# Altium project Kasil_DIOT_x86_board.PrjPcb (part 4 of 4)

## Sheet PCIe_MUX_CLK.SchDoc
size 420 x 297 mm; SheetNumber: 10; SheetTotal: 11; ModifiedBy: -; CheckedDate: -; Title2: Title 2; DivGrp: WUT ISE; Designer: G.Kasprowicz
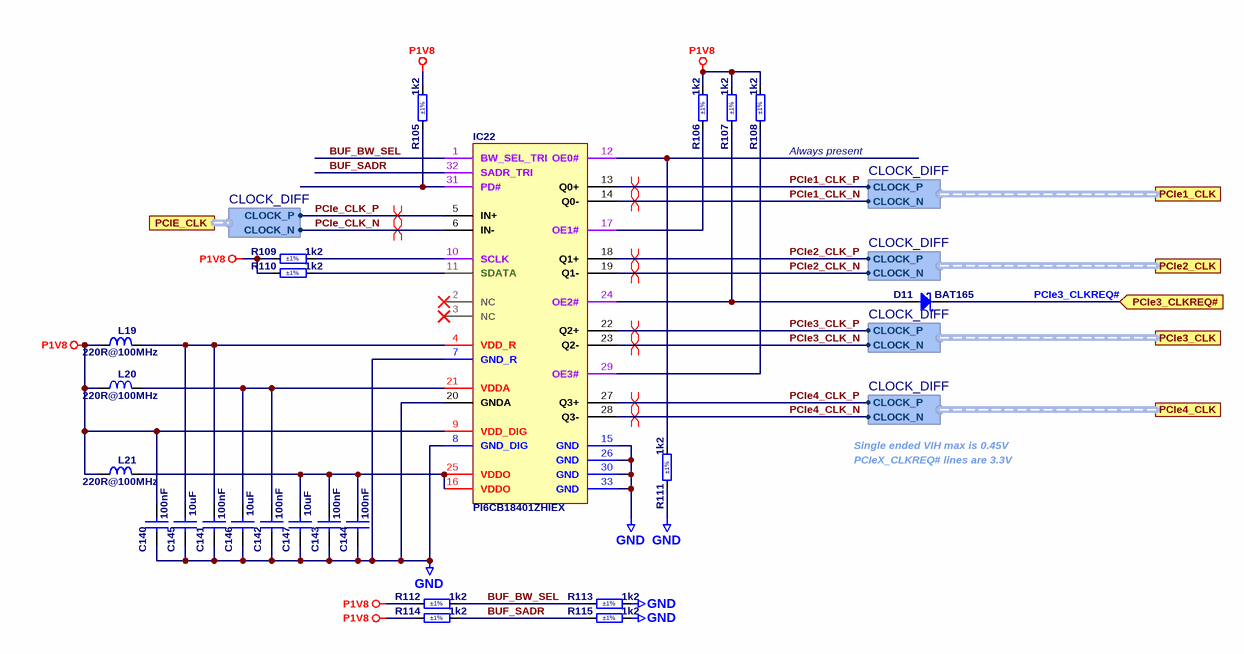
[diagram p9: PCIe_MUX_CLK.SchDoc]

### Parts
C140  100nF  [CAPC1005X55N]
C141  100nF  [CAPC1005X55N]
C142  100nF  [CAPC1005X55N]
C143  100nF  [CAPC1005X55N]
C144  100nF  [CAPC1005X55N]
C145  10uF  [CAPC1608X80N]
C146  10uF  [CAPC1608X80N]
C147  10uF  [CAPC1608X80N]
D11  BAT165  [SOD2512X110N]
IC22  PI6CB18401ZHIEX  [PERICOM_32-TQFN(ZH)]
L19  220R@100MHz  [INDC2012X105N]
L20  220R@100MHz  [INDC2012X105N]
L21  220R@100MHz  [INDC2012X105N]
R105  1k2  Tolerance: ±1%  [RESC1005X40N]
R106  1k2  Tolerance: ±1%  [RESC1005X40N]
R107  1k2  Tolerance: ±1%  [RESC1005X40N]
R108  1k2  Tolerance: ±1%  [RESC1005X40N]
R109  1k2  Tolerance: ±1%  [RESC1005X40N]
R110  1k2  Tolerance: ±1%  [RESC1005X40N]
R111  1k2  Tolerance: ±1%  [RESC1005X40N]
R112  1k2  Tolerance: ±1%  [RESC1005X40N]
R113  1k2  Tolerance: ±1%  [RESC1005X40N]
R114  1k2  Tolerance: ±1%  [RESC1005X40N]
R115  1k2  Tolerance: ±1%  [RESC1005X40N]

### Ports
PCIe1_CLK (harness CLOCK_DIFF), PCIe2_CLK (harness CLOCK_DIFF), PCIe3_CLK (harness CLOCK_DIFF), PCIe3_CLKREQ# (in), PCIe4_CLK (harness CLOCK_DIFF), PCIE_CLK (harness CLOCK_DIFF)

### Harnesses
CLOCK_DIFF: CLOCK_P, CLOCK_N

### Nets
GND: C140.1 C141.1 C142.1 C143.1 C144.1 C145.1 C146.1 C147.1 IC22.7(GND_R) IC22.8(GND_DIG) IC22.15(GND) IC22.20(GNDA) IC22.26(GND) IC22.30(GND) IC22.33(GND) R111.1 R113.2 R115.2
P1V8: C140.2 IC22.9(VDD_DIG) L19.1 L20.1 L21.1 R105.2 R106.2 R107.2 R108.2 R109.1 R110.1 R112.1 R114.1
BUF_BW_SEL: IC22.1(BW_SEL_TRI) R112.2 R113.1
BUF_SADR: IC22.32(SADR_TRI) R114.2 R115.1
PCIe1_CLK_N: IC22.14(Q0-) ; port PCIe1_CLK.CLOCK_N
PCIe1_CLK_P: IC22.13(Q0+) ; port PCIe1_CLK.CLOCK_P
PCIe2_CLK_N: IC22.19(Q1-) ; port PCIe2_CLK.CLOCK_N
PCIe2_CLK_P: IC22.18(Q1+) ; port PCIe2_CLK.CLOCK_P
PCIe3_CLK_N: IC22.23(Q2-) ; port PCIe3_CLK.CLOCK_N
PCIe3_CLK_P: IC22.22(Q2+) ; port PCIe3_CLK.CLOCK_P
PCIe3_CLKREQ#: D11.1(C) ; port PCIe3_CLKREQ#
PCIe4_CLK_N: IC22.28(Q3-) ; port PCIe4_CLK.CLOCK_N
PCIe4_CLK_P: IC22.27(Q3+) ; port PCIe4_CLK.CLOCK_P
PCIe_CLK_N: IC22.6(IN-) ; port PCIE_CLK.CLOCK_N
PCIe_CLK_P: IC22.5(IN+) ; port PCIE_CLK.CLOCK_P
NetC141_2: C141.2 C145.2 IC22.4(VDD_R) L19.2
NetC142_2: C142.2 C146.2 IC22.21(VDDA) L20.2
NetC143_2: C143.2 C144.2 C147.2 IC22.16(VDDO) IC22.25(VDDO) L21.2
NetD11_2: D11.2(A) IC22.24(OE2#) R107.1
NetIC22_10: IC22.10(SCLK) R109.2
NetIC22_11: IC22.11(SDATA) R110.2
NetIC22_12: IC22.12(OE0#) R111.2
NetIC22_17: IC22.17(OE1#) R106.1
NetIC22_29: IC22.29(OE3#) R108.1
NetIC22_31: IC22.31(PD#) R105.1

Not connected (* = marked no-connect by the designer): IC22 2(NC)* 3(NC)*

### Layout directives
differential pair: PCIe1_CLK_N, PCIe1_CLK_P, PCIe2_CLK_N, PCIe2_CLK_P, PCIe3_CLK_N, PCIe3_CLK_P, PCIe4_CLK_N, PCIe4_CLK_P, PCIe_CLK_N, PCIe_CLK_P

### Notes on the sheet
- (near R108) Always present
- Single ended VIH max is 0.45V
- PCIeX_CLKREQ# lines are 3.3V
- Project/Equipment
- Document
- Designer
- Drawn by
- Check.by
- Copyright WUT ISE 2024.
  This documentation describes Open Hardware and is licensed under the CERN OHL v.2. You may redistribute and modify this documentation under the terms of the CERN OHL v.2. (http://ohwr.org/CERNOHL). This documentation is distributed WITHOUT ANY EXPRESS OR IMPLIED WARRANTY, INCLUDING OF MERCHANTABILITY, SATISFACTORY QUALITY AND FITNESS FOR A PARTICULAR PURPOSE. Please see the CERN OHL v.2 for applicable conditions.
- Contact
- File
- Last Mod.
- Print Date
- Sheet
- Size
- A3
- of
- Rev

### Library data of the parts
C140-C144 = CC0402_100NF_16V_10%_X7R: Non-polarised capacitor; Part Description: SMD Multilayer Chip Ceramic Capacitor; Manufacturer: GENERIC; Manufacturer1 Part Number: GRM155R71C104KA88D; Voltage: 16V; TC: X7R; Tolerance: ±10%; Part Number: CC0402_100NF_16V_10%_X7R; Component Kind: Standard; Component Type: Standard; Pin Count: 2; Value: 100nF; Status: Not Recommended; Manufacturer Part Number: CC0402_100NF_16V_10%_X7R; Case: 0402; Mounted: Yes; Socket: No; SMD: Yes; Sense: No; Manufacturer1 Example: MURATA; Manufacturer1 ComponentHeight: 0.55mm; HelpURL: \\cern.ch\dfs\Applications\Altium\Datasheets\CC0402_X7R_MURATA_GRM.pdf; Author: CERN DEM JLC; CreateDate: 05/12/2013; LatestRevisionDate: 03/12/2007
C145-C147 = CC0603_10UF_16V_20%_X5R: Non-polarised capacitor; Part Description: SMD Multilayer Chip Ceramic Capacitor; Manufacturer: GENERIC; Manufacturer1 Part Number: GRM188R61C106MA73D; Voltage: 16V; TC: X5R; Tolerance: ±20%; Part Number: CC0603_10UF_16V_20%_X5R; Component Kind: Standard; Component Type: Standard; Pin Count: 2; Value: 10uF; Status: None; Manufacturer Part Number: CC0603_10UF_16V_20%_X5R; Case: 0603; Mounted: Yes; Socket: No; SMD: Yes; Sense: No; Manufacturer1 Example: MURATA; Manufacturer1 ComponentHeight: 0.8mm; HelpURL: \\cern.ch\dfs\Applications\Altium\Datasheets\CC0603_X5R_MURATA_GRM.pdf; Author: CERN DEM MR; CreateDate: 02.03.2016; LatestRevisionDate: 02.03.2016
D11 = BAT165: Schottky Diode; Part Description: Medium Power AF Schottky Diode; Manufacturer: INFINEON; Voltage: 40V; Power: 750mA; PressFit: No; Bonding: No; Part Number: BAT165; Component Kind: Standard; Component Type: Standard; Device: BAT165; PackageDescription: Small Outline Diode (SOD-323), 1.70mm W X 1.25mm L X 1.10mm H body,  IPC Medium Density; Manufacturer Part Number: BAT165; Pin Count: 2; Case: SOD-323; Mounted: Yes; Socket: No; SMD: Yes; Sense: No; ComponentHeight: 1.1mm; HelpURL: \\cern.ch\dfs\Applications\Altium\Datasheets\BAT165.pdf; Author: CERN DEM JLC; CreateDate: 12.11.2014; LatestRevisionDate: 12.11.2014
IC22 = PI6CB18401: Very Low Power 4-Output PCIe Clock Buffer With On-chip Termination
L19-L21 = IND0805_MURATA_BLM21PG221SN1D: Inductor; Part Description: SMD EMIFIL Suppression Chip Bead Ferrite; Manufacturer: MURATA; Power: 2A; Resistance: 0.05R; Tolerance: ±25%; Table: Inductors SMD; Part Number: IND0805_MURATA_BLM21PG221SN1D; Component Kind: Standard; Component Type: Standard; Pin Count: 2; Value: 220R@100MHz; Status: None; Manufacturer Part Number: BLM21PG221SN1D; Case: 0805; Mounted: Yes; Socket: No; SMD: Yes; ComponentHeight: 1.05mm; HelpURL: \\cern.ch\dfs\Applications\Altium\Datasheets\IND0402_MURATA_BLM21P.pdf; Author: CERN DEM JLC; CreateDate: 25/01/2010; LatestRevisionDate: 25/01/2010
R105-R115 = R0402_1K2_1%_0.0625W_100PPM: Resistor - 1%; Part Description: General Purpose Thick Film Chip Resistor; Manufacturer: GENERIC; Manufacturer 1: YAGEO PHYCOMP; Manufacturer 1 Part Number: 232270671202L; TC: ±100ppm/°C; PressFit: No; Part Number: R0402_1K2_1%_0.0625W_100PPM; Component Kind: Standard; Component Type: Standard; Pin Count: 2; Value: 1k2; Status: Not Recommended; Power: 0.0625W; Manufacturer Part Number: R0402_1K2_1%_0.0625W_100PPM; Case: 0402; Mounted: Yes; Sense: No; Socket: No; SMD: Yes; Manufacturer1 ComponentHeight: 0.4mm; HelpURL: \\cern.ch\dfs\Applications\Altium\Datasheets\R0402_Phycomp_RC0402.pdf; Author: CERN DEM JLC; CreateDate: 03.12.2007; LatestRevisionDate: 17.10.2012

## Sheet DualUSB2.0_HDR.SchDoc
size 420 x 297 mm; SheetNumber: 11; SheetTotal: 11; ModifiedBy: -; CheckedDate: -; Title2: Title 2; DivGrp: WUT ISE; Designer: G.Kasprowicz
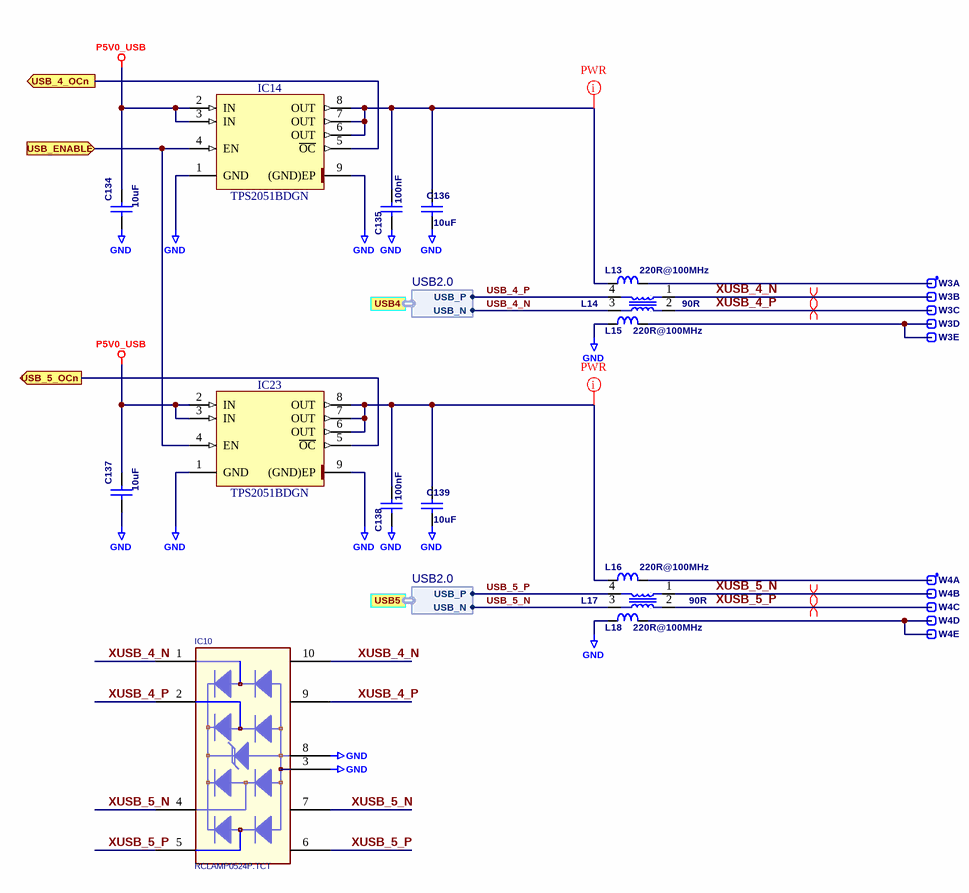
[diagram p10: DualUSB2.0_HDR.SchDoc]

### Parts
C134  10uF  [CAPC2012X135N]
C135  100nF  [CAPC1005X55N]
C136  10uF  [CAPC2012X135N]
C137  10uF  [CAPC2012X135N]
C138  100nF  [CAPC1005X55N]
C139  10uF  [CAPC2012X135N]
IC10  RCLAMP0524P.TCT  [SMDARRAYC_10P4C]
IC14  TPS2051BDGN  [SOP65P490X110-9N-R157X189]
IC23  TPS2051BDGN  [SOP65P490X110-9N-R157X189]
L13  220R@100MHz  [INDC2012X105N]
L14  value 90R  [DLSCM0805]  (hidden comment: DLSCM0805-900M or DLW21SN900SQ2L)
L15  220R@100MHz  [INDC2012X105N]
L16  220R@100MHz  [INDC2012X105N]
L17  value 90R  [DLSCM0805]  (hidden comment: DLSCM0805-900M or DLW21SN900SQ2L)
L18  220R@100MHz  [INDC2012X105N]
W3  Header 5  [SAMTEC_MTLW-105-07-L-S-250]  (value not drawn)  (parts A,B,C,D,E of 5)
W4  Header 5  [SAMTEC_MTLW-105-07-L-S-250]  (value not drawn)  (parts A,B,C,D,E of 5)

### Ports
USB4 (harness USB2.0), USB5 (harness USB2.0), USB_4_OCn (out), USB_5_OCn (out), USB_ENABLE (in)

### Harnesses
USB2.0: USB_P, USB_N

### Nets
GND: C134.1 C135.1 C136.1 C137.1 C138.1 C139.1 IC10.3 IC10.8 IC14.1(GND) IC14.9((GND)EP) IC23.1(GND) IC23.9((GND)EP) L15.1 L18.1
P5V0_USB: C134.2 C137.2 IC14.2(IN) IC14.3(IN) IC23.2(IN) IC23.3(IN)
CARRIER_PWRON: IC14.4(EN) IC23.4(EN) ; port USB_ENABLE
USB_4_N: L14.3 ; port USB4.USB_N
USB_4_P: L14.4 ; port USB4.USB_P
USB_5_N: L17.3 ; port USB5.USB_N
USB_5_OCn: IC23.5(~{OC}) ; port USB_5_OCn
USB_5_P: L17.4 ; port USB5.USB_P
XUSB_4_N: IC10.1 IC10.10 L14.1 W3.2
XUSB_4_P: IC10.2 IC10.9 L14.2 W3.3
XUSB_5_N: IC10.4 IC10.7 L17.1 W4.2
XUSB_5_P: IC10.5 IC10.6 L17.2 W4.3
NetC135_2: C135.2 C136.2 IC14.6(OUT) IC14.7(OUT) IC14.8(OUT) L13.1
NetC138_2: C138.2 C139.2 IC23.6(OUT) IC23.7(OUT) IC23.8(OUT) L16.1
NetIC14_5: IC14.5(~{OC}) ; port USB_4_OCn
NetL13_2: L13.2 W3.1
NetL15_2: L15.2 W3.4 W3.5
NetL16_2: L16.2 W4.1
NetL18_2: L18.2 W4.4 W4.5

### Layout directives
differential pair: XUSB_4_N, XUSB_4_P, XUSB_5_N, XUSB_5_P
net class PWR: NetC135_2, NetC138_2

### Notes on the sheet
- Project/Equipment
- Document
- Designer
- Drawn by
- Check.by
- Copyright WUT ISE 2024.
  This documentation describes Open Hardware and is licensed under the CERN OHL v.2. You may redistribute and modify this documentation under the terms of the CERN OHL v.2. (http://ohwr.org/CERNOHL). This documentation is distributed WITHOUT ANY EXPRESS OR IMPLIED WARRANTY, INCLUDING OF MERCHANTABILITY, SATISFACTORY QUALITY AND FITNESS FOR A PARTICULAR PURPOSE. Please see the CERN OHL v.2 for applicable conditions.
- Contact
- File
- Last Mod.
- Print Date
- Sheet
- Size
- A3
- of
- Rev

### Library data of the parts
C134 C136 C137 C139 = CC0805_10UF_10V_10%_X7R: Non-polarised capacitor; Part Description: SMD Multilayer Chip Ceramic Capacitor; Manufacturer: GENERIC; Manufacturer1 Part Number: GRM21BR71A106KE51L; Voltage: 10V; TC: X7R; Tolerance: ±10%; Table: Capacitors SMD; Part Number: CC0805_10UF_10V_10%_X7R; Component Kind: Standard; Component Type: Standard; Pin Count: 2; Value: 10uF; Status: Preferred; Manufacturer Part Number: CC0805_10UF_10V_10%_X7R; Case: 0805; Mounted: Yes; Socket: No; SMD: Yes; Manufacturer1 Example: MURATA; Manufacturer1 ComponentHeight: 1.35mm; HelpURL: \\cern.ch\dfs\Applications\Altium\Datasheets\CC0805_X7R_MURATA.pdf; Author: CERN DEM JLC; CreateDate: 2012-04-30; LatestRevisionDate: 2012-04-30
C135 C138 = CC0402_100NF_16V_10%_X7R: as C140 on sheet PCIe_MUX_CLK; Part Number: CC0402_100NF_16V_10%_X7R; Component Kind: Standard; Component Type: Standard; Pin Count: 2; Value: 100nF; Status: Not Recommended; Manufacturer Part Number: CC0402_100NF_16V_10%_X7R; Case: 0402; Mounted: Yes; Socket: No; SMD: Yes; Sense: No; Manufacturer1 Example: MURATA; Manufacturer1 ComponentHeight: 0.55mm; HelpURL: \\cern.ch\dfs\Applications\Altium\Datasheets\CC0402_X7R_MURATA_GRM.pdf; Author: CERN DEM JLC; CreateDate: 05/12/2013; LatestRevisionDate: 03/12/2007
IC10 = D_TVS_RCLAMP0524P: DIODE,RCLAMP0524P,SEMTECH; Specification: SMD,ESD COMPONENT,ROHS
IC14 IC23 = TPS2051BDGN: One Channel, Current-Limited, Power-Distribution Switches; Part Description: One Channel, Current-Limited (500mA), Power-Distribution Switches; Manufacturer: TEXAS INSTRUMENTS; PressFit: No; Bonding: No; Part Number: TPS2051BDGN; Component Kind: Standard; Component Type: Standard; Device: TPS2051BDGN; PackageDescription: SOP, 0.65mm Pitch; 8 Pin, 3.00mm W X 3.00mm L X 1.10mm H body (w/Thermal Tab 1.57 X 1.89mm), IPC Medium Density; Manufacturer Part Number: TPS2051BDGN; Pin Count: 8; Case: SSOP8; Mounted: Yes; Socket: No; SMD: Yes; Sense: No; ComponentHeight: 1.1mm; Author: CERN DEM BC; HelpURL: \\cern.ch\dfs\Applications\Altium\Datasheets\TPS2051BDGN.pdf; CreateDate: 06.07.2020; LatestRevisionDate: 06.07.2020
L13 L15 L16 L18 = IND0805_MURATA_BLM21PG221SN1D: Inductor; Part Description: SMD EMIFIL Suppression Chip Ferrite Bead; Manufacturer: MURATA; Power: 2A; Resistance: 0.05R; Tolerance: ±25%; Table: Inductors SMD; Part Number: IND0805_MURATA_BLM21PG221SN1D; Component Kind: Standard; Component Type: Standard; Pin Count: 2; Value: 220R@100MHz; Status: None; Manufacturer Part Number: BLM21PG221SN1D; Case: 0805; Mounted: Yes; Socket: No; SMD: Yes; ComponentHeight: 1.05mm; HelpURL: \\cern.ch\dfs\Applications\Altium\Datasheets\IND0402_MURATA_BLM21P.pdf; Author: CERN DEM JLC; CreateDate: 2010-01-25; LatestRevisionDate: 2010-01-25
L14 L17 = L_CMC_DLSCM0805_90R: Common Mode Choke 90R
W3 W4 = SAMTEC_MTLW-105-07-L-S-250: 5 Mini Wire-Wrap Contact Strip Header; Part Description: 5 Contacts, Pitch 2.54mm, Single Row Through Mount Straight Header (Post Lead = 6.35mm, Tail Lead 3.05mm, Insulator 1.52mm); Manufacturer: SAMTEC; PressFit: No; Part Number: SAMTEC_MTLW-105-07-L-S-250; Component Kind: Standard; Component Type: Standard; Pin Count: 5; Family: Header 5; Mounted: Yes; Socket: No; SMD: No; Sense: No; Status: None; Manufacturer Part Number: MTLW-105-07-L-S-250; ComponentHeight: 7.87mm; HelpURL: \\cern.ch\dfs\Applications\Altium\Datasheets\SAMTEC_MTLW-105-07-L-S-250.pdf; Author: CERN DEM JLC; CreateDate: 07.01.2015; LatestRevisionDate: 07.01.2015

## Nets that join several sheets
GND: Kasil_DIOT_x86_board (C45.1 R18.1), SMARC_CON (65 pins), DisplayPort_CON (15 pins), DualETH_CON (45 pins), DualUSB2.0_CON (14 pins), DualUSB3.0_CON (18 pins), LOCAL_PWR (86 pins), KASLI_CON (45 pins), M.2_NVME_CON (37 pins), PCIe_MUX_CLK (18 pins), DualUSB2.0_HDR (14 pins)
P1V1: DualETH_CON (11 pins), LOCAL_PWR (R71.2)
P1V8: DualETH_CON (8 pins), LOCAL_PWR (9 pins), KASLI_CON (7 pins), PCIe_MUX_CLK (13 pins)
P2V5: DualETH_CON (8 pins), LOCAL_PWR (R83.2)
P3V3: DisplayPort_CON (FB1.1), DualETH_CON (26 pins), LOCAL_PWR (8 pins), M.2_NVME_CON (31 pins)
P5V0_SMARC: SMARC_CON (20 pins), LOCAL_PWR (R57.2 R67.2)
P5V0_USB: DualUSB2.0_CON (6 pins), DualUSB3.0_CON (6 pins), LOCAL_PWR (R64.2 SW2.1), DualUSB2.0_HDR (6 pins)
P12V0_KASLI: LOCAL_PWR (13 pins), KASLI_CON (C12.2 J1.75 J1.77 J1.79)
SHIELD: Kasil_DIOT_x86_board (C45.2 R18.2), DisplayPort_CON (CON1.SHIELD), DualETH_CON (CON6.18 CON6.19), DualUSB2.0_CON (CON2.SH), DualUSB3.0_CON (CON5.19 CON5.20)
(S)ATA_ACT#: SMARC_CON (M1.S54), M.2_NVME_CON (R102.1)
BOARD_RESET: DualETH_CON (R41.1), LOCAL_PWR (T2.6)
BOOT_SEL0#_1V8: SMARC_CON (M1.P123), LOCAL_PWR (D1.1 SW1.8)
BOOT_SEL1#_1V8: SMARC_CON (M1.P124), LOCAL_PWR (D2.1 SW1.7)
BOOT_SEL2#_1V8: SMARC_CON (M1.P125), LOCAL_PWR (D3.1 SW1.6)
CARRIER_PWRON: DualUSB2.0_CON (IC7.4 IC8.4), DualUSB3.0_CON (IC11.4 IC12.4), LOCAL_PWR (IC19.19 R78.2 R92.1 T1.3), DualUSB2.0_HDR (IC14.4 IC23.4)
CARRIER_PWRON_1V8: SMARC_CON (M1.S154), LOCAL_PWR (R75.1)
DDI0_CTRL_AUX_N: SMARC_CON (M1.S105), DisplayPort_CON (R8.1)
DDI0_CTRL_AUX_P: SMARC_CON (M1.S106), DisplayPort_CON (R7.1)
DDI0_HPD: SMARC_CON (M1.S98), DisplayPort_CON (R6.1)
DDI0_PAIR0_N: SMARC_CON (M1.S94), DisplayPort_CON (C20.1)
DDI0_PAIR0_P: SMARC_CON (M1.S93), DisplayPort_CON (C19.1)
DDI0_PAIR1_N: SMARC_CON (M1.S97), DisplayPort_CON (C23.1)
DDI0_PAIR1_P: SMARC_CON (M1.S96), DisplayPort_CON (C21.1)
DDI0_PAIR2_N: SMARC_CON (M1.S100), DisplayPort_CON (C26.1)
DDI0_PAIR2_P: SMARC_CON (M1.S99), DisplayPort_CON (C25.1)
DDI0_PAIR3_N: SMARC_CON (M1.S103), DisplayPort_CON (C24.1)
DDI0_PAIR3_P: SMARC_CON (M1.S102), DisplayPort_CON (C22.1)
FORCE_RECOV#_1V8: SMARC_CON (M1.S155), LOCAL_PWR (D4.1 SW1.5)
GBE0_ACT#: SMARC_CON (M1.P25), DualETH_CON (R19.1)
GBE0_CTREF: SMARC_CON (M1.P28), DualETH_CON (8 pins)
GBE0_LINK100#: SMARC_CON (M1.P21), DualETH_CON (R20.1)
GBE0_LINK1000#: SMARC_CON (M1.P22), DualETH_CON (R21.1)
GBE0_MDI0_N: SMARC_CON (M1.P29), DualETH_CON (CON6.10)
GBE0_MDI0_P: SMARC_CON (M1.P30), DualETH_CON (CON6.11)
GBE0_MDI1_N: SMARC_CON (M1.P26), DualETH_CON (CON6.5)
GBE0_MDI1_P: SMARC_CON (M1.P27), DualETH_CON (CON6.4)
GBE0_MDI2_N: SMARC_CON (M1.P23), DualETH_CON (CON6.2)
GBE0_MDI2_P: SMARC_CON (M1.P24), DualETH_CON (CON6.3)
GBE0_MDI3_N: SMARC_CON (M1.P19), DualETH_CON (CON6.9)
GBE0_MDI3_P: SMARC_CON (M1.P20), DualETH_CON (CON6.8)
GBE1_ACT#: SMARC_CON (M1.S31), DualETH_CON (R27.1)
GBE1_CTREF: SMARC_CON (M1.S28), DualETH_CON (C50.2)
GBE1_LINK100#: SMARC_CON (M1.S19), DualETH_CON (R30.1)
GBE1_LINK1000#: SMARC_CON (M1.S22), DualETH_CON (R31.1)
GBE1_MDI0_N: SMARC_CON (M1.S18), DualETH_CON (C57.2 R44.1)
GBE1_MDI0_P: SMARC_CON (M1.S17), DualETH_CON (C56.2 R45.1)
GBE1_MDI1_N: SMARC_CON (M1.S21), DualETH_CON (C59.2 R42.1)
GBE1_MDI1_P: SMARC_CON (M1.S20), DualETH_CON (C58.2 R43.1)
GBE1_MDI2_N: SMARC_CON (M1.S24), DualETH_CON (C61.2 R51.2)
GBE1_MDI2_P: SMARC_CON (M1.S23), DualETH_CON (C60.2 R50.2)
GBE1_MDI3_N: SMARC_CON (M1.S27), DualETH_CON (C68.2 R53.2)
GBE1_MDI3_P: SMARC_CON (M1.S26), DualETH_CON (C62.2 R52.2)
GPIO0: SMARC_CON (M1.P108), KASLI_CON (IC3.6)
GPIO1: SMARC_CON (M1.P109), KASLI_CON (IC3.7)
GPIO2: SMARC_CON (M1.P110), KASLI_CON (IC3.8)
GPIO3: SMARC_CON (M1.P111), KASLI_CON (IC3.9)
GPIO4: SMARC_CON (M1.P112), KASLI_CON (IC3.4)
GPIO7: SMARC_CON (M1.P115), KASLI_CON (IC3.5)
NetIC14_5: SMARC_CON (M1.P76), DualUSB2.0_HDR (IC14.5)
NetM1_P113: SMARC_CON (M1.P113), LOCAL_PWR (T3.2)
NetM1_P114: SMARC_CON (M1.P114), LOCAL_PWR (R94.1 T4.6)
PCIe1_CLK_N: KASLI_CON (J1.54), PCIe_MUX_CLK (IC22.14)
PCIe1_CLK_P: KASLI_CON (J1.52), PCIe_MUX_CLK (IC22.13)
PCIe1_rst_3V3: SMARC_CON (M1.P75), KASLI_CON (J1.53)
PCIe1_RX_N: SMARC_CON (M1.P87), KASLI_CON (J1.28)
PCIe1_RX_P: SMARC_CON (M1.P86), KASLI_CON (J1.30)
PCIe1_TX_N: SMARC_CON (M1.P90), KASLI_CON (J1.40)
PCIe1_TX_P: SMARC_CON (M1.P89), KASLI_CON (J1.42)
PCIe2_RX_N: SMARC_CON (M1.S88), KASLI_CON (J1.22)
PCIe2_RX_P: SMARC_CON (M1.S87), KASLI_CON (J1.24)
PCIe2_TX_N: SMARC_CON (M1.S91), KASLI_CON (J1.46)
PCIe2_TX_P: SMARC_CON (M1.S90), KASLI_CON (J1.48)
PCIe3_CLK_N: M.2_NVME_CON (*.53), PCIe_MUX_CLK (IC22.23)
PCIe3_CLK_P: M.2_NVME_CON (*.55), PCIe_MUX_CLK (IC22.22)
PCIe3_CLKREQ#: M.2_NVME_CON (*.52), PCIe_MUX_CLK (D11.1)
PCIe3_RST: SMARC_CON (M1.S77), M.2_NVME_CON (*.50)
PCIe3_RX_N: SMARC_CON (M1.S79), M.2_NVME_CON (IC21.18)
PCIe3_RX_P: SMARC_CON (M1.S78), M.2_NVME_CON (IC21.19)
PCIe3_TX_N: SMARC_CON (M1.S82), M.2_NVME_CON (IC21.16)
PCIe3_TX_P: SMARC_CON (M1.S81), M.2_NVME_CON (IC21.17)
PCIe4_RX_N: SMARC_CON (M1.S33), M.2_NVME_CON (*.29)
PCIe4_RX_P: SMARC_CON (M1.S32), M.2_NVME_CON (*.31)
PCIe4_TX_N: SMARC_CON (M1.S30), M.2_NVME_CON (*.35)
PCIe4_TX_P: SMARC_CON (M1.S29), M.2_NVME_CON (*.37)
PCIe_CLK_N: SMARC_CON (M1.P84), PCIe_MUX_CLK (IC22.6)
PCIe_CLK_P: SMARC_CON (M1.P83), PCIe_MUX_CLK (IC22.5)
PCIe_Wake_3V3: SMARC_CON (M1.S146), KASLI_CON (J1.55), M.2_NVME_CON (*.54)
PWRBTN#_1V8: SMARC_CON (M1.P128), LOCAL_PWR (C114.2 D6.1 PB1.1 T5.6)
RESET_BTN#_1V8: SMARC_CON (M1.P127), LOCAL_PWR (C116.2 D9.1 PB2.1 T5.3)
RESET_OUT#_1V8: SMARC_CON (M1.P126), LOCAL_PWR (R68.1 T2.5)
SATA0_RX_N: SMARC_CON (M1.P52), M.2_NVME_CON (IC21.15)
SATA0_RX_P: SMARC_CON (M1.P51), M.2_NVME_CON (IC21.14)
SATA0_TX_N: SMARC_CON (M1.P49), M.2_NVME_CON (IC21.12)
SATA0_TX_P: SMARC_CON (M1.P48), M.2_NVME_CON (IC21.13)
SER0_CTS: SMARC_CON (M1.P132), KASLI_CON (IC1.7)
SER0_RTS: SMARC_CON (M1.P131), KASLI_CON (IC2.7)
SER0_RX: SMARC_CON (M1.P130), KASLI_CON (IC1.6)
SER0_TX: SMARC_CON (M1.P129), KASLI_CON (IC2.6)
SER2_CTS: SMARC_CON (M1.P139), KASLI_CON (IC1.9)
SER2_RTS: SMARC_CON (M1.P138), KASLI_CON (IC2.9)
SER2_RX: SMARC_CON (M1.P137), KASLI_CON (IC1.8)
SER2_TX: SMARC_CON (M1.P136), KASLI_CON (IC2.8)
SFPRX_N: DualETH_CON (IC17.17), KASLI_CON (J1.18)
SFPRX_P: DualETH_CON (IC17.16), KASLI_CON (J1.16)
SFPTX_N: DualETH_CON (IC17.14), KASLI_CON (J1.10)
SFPTX_P: DualETH_CON (IC17.15), KASLI_CON (J1.12)
USB_0_N: SMARC_CON (M1.P61), DualUSB2.0_CON (L3.4)
USB_0_OCn: SMARC_CON (M1.P62), DualUSB2.0_CON (IC7.5)
USB_0_P: SMARC_CON (M1.P60), DualUSB2.0_CON (L3.3)
USB_1_N: SMARC_CON (M1.P66), DualUSB2.0_CON (L4.4)
USB_1_OCn: SMARC_CON (M1.P67), DualUSB2.0_CON (IC8.5)
USB_1_P: SMARC_CON (M1.P65), DualUSB2.0_CON (L4.3)
USB_2_N: SMARC_CON (M1.P70), DualUSB3.0_CON (L10.2)
USB_2_OCn: SMARC_CON (M1.P71), DualUSB3.0_CON (IC11.5)
USB_2_P: SMARC_CON (M1.P69), DualUSB3.0_CON (L10.1)
USB_2_RX_N: SMARC_CON (M1.S75), DualUSB3.0_CON (C149.1)
USB_2_RX_P: SMARC_CON (M1.S74), DualUSB3.0_CON (C36.1)
USB_2_TX_N: SMARC_CON (M1.S72), DualUSB3.0_CON (R38.1)
USB_2_TX_P: SMARC_CON (M1.S71), DualUSB3.0_CON (R13.1)
USB_3_N: SMARC_CON (M1.S69), DualUSB3.0_CON (L9.2)
USB_3_OCn: SMARC_CON (M1.P74), DualUSB3.0_CON (IC12.5)
USB_3_P: SMARC_CON (M1.S68), DualUSB3.0_CON (L9.1)
USB_3_RX_N: SMARC_CON (M1.S66), DualUSB3.0_CON (C151.1)
USB_3_RX_P: SMARC_CON (M1.S65), DualUSB3.0_CON (C150.1)
USB_3_TX_N: SMARC_CON (M1.S63), DualUSB3.0_CON (R40.1)
USB_3_TX_P: SMARC_CON (M1.S62), DualUSB3.0_CON (R39.1)
USB_4_N: SMARC_CON (M1.S36), DualUSB2.0_HDR (L14.3)
USB_4_P: SMARC_CON (M1.S35), DualUSB2.0_HDR (L14.4)
USB_5_N: SMARC_CON (M1.S60), DualUSB2.0_HDR (L17.3)
USB_5_OCn: SMARC_CON (M1.S55), DualUSB2.0_HDR (IC23.5)
USB_5_P: SMARC_CON (M1.S59), DualUSB2.0_HDR (L17.4)